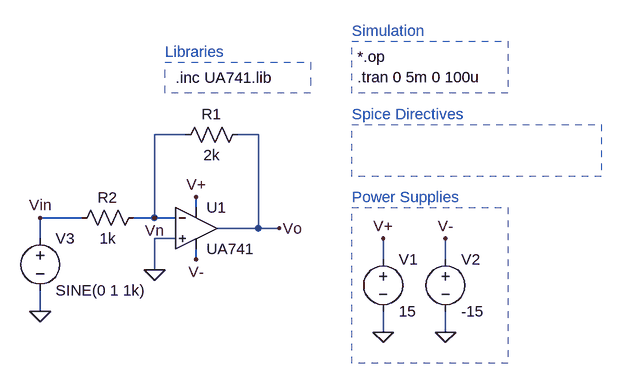
[diagram p0: schematic External_Library_Example.asc]
External_Library_Example.asc, the LTspice schematic file:
Version 4
SHEET 1 1432 696
WIRE 384 176 336 176
WIRE 496 176 464 176
WIRE 400 288 400 272
WIRE 224 304 160 304
WIRE 336 304 336 176
WIRE 336 304 304 304
WIRE 368 304 336 304
WIRE 496 320 496 176
WIRE 496 320 432 320
WIRE 528 320 496 320
WIRE 160 336 160 304
WIRE 368 336 336 336
WIRE 400 368 400 352
WIRE 688 368 688 336
WIRE 784 368 784 336
WIRE 336 384 336 336
WIRE 160 448 160 416
WIRE 688 480 688 448
WIRE 784 480 784 448
FLAG 784 480 0
FLAG 688 480 0
FLAG 688 336 V+
FLAG 784 336 V-
FLAG 400 272 V+
FLAG 400 368 V-
FLAG 528 320 Vo
FLAG 336 384 0
FLAG 160 448 0
FLAG 160 304 Vin
FLAG 336 304 Vn
SYMBOL OpAmps\\opamp2 400 256 R0
SYMATTR InstName U1
SYMATTR Value UA741
SYMBOL voltage 688 352 R0
SYMATTR InstName V1
SYMATTR Value 15
SYMBOL voltage 784 352 R0
SYMATTR InstName V2
SYMATTR Value -15
SYMBOL res 480 160 R90
WINDOW 0 0 56 VBottom 2
WINDOW 3 32 56 VTop 2
SYMATTR InstName R1
SYMATTR Value 2k
SYMBOL res 320 288 R90
WINDOW 0 0 56 VBottom 2
WINDOW 3 32 56 VTop 2
SYMATTR InstName R2
SYMATTR Value 1k
SYMBOL voltage 160 320 R0
WINDOW 123 0 0 Left 0
WINDOW 39 0 0 Left 0
SYMATTR InstName V3
SYMATTR Value SINE(0 1 1k)
TEXT 640 16 Left 2 ;Simulation
TEXT 368 88 Left 2 !.inc UA741.lib
TEXT 648 56 Left 2 !*.op\n.tran 0 5m 0 100u
TEXT 640 144 Left 2 ;Spice Directives
TEXT 640 272 Left 2 ;Power Supplies
TEXT 352 48 Left 2 ;Libraries
RECTANGLE Normal 1024 240 640 160 2
RECTANGLE Normal 880 528 640 288 2
RECTANGLE Normal 576 112 352 64 2
RECTANGLE Normal 880 112 640 32 2

The netlist it stands for:
* External_Library_Example.asc
XU1 0 Vn V+ V- Vo UA741  ; pins In+ In- V+ V- OUT
V1 V+ 0 15
V2 V- 0 -15
R1 Vo Vn 2k
R2 Vn Vin 1k
V3 Vin 0 SINE(0 1 1k)
* Simulation
.inc UA741.lib
*.op
.tran 0 5m 0 100u
* Spice Directives
* Power Supplies
* Libraries
.backanno
.end